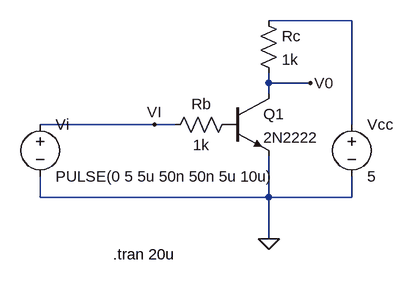
[diagram p0: schematic 1.2.3.asc]
1.2.3.asc, the LTspice schematic file:
Version 4
SHEET 1 880 680
WIRE 384 -32 256 -32
WIRE 256 64 256 48
WIRE 320 64 256 64
WIRE 256 80 256 64
WIRE 80 128 -96 128
WIRE 112 128 80 128
WIRE 384 128 384 -32
WIRE -96 240 -96 208
WIRE 256 240 256 176
WIRE 256 240 -96 240
WIRE 384 240 384 208
WIRE 384 240 256 240
WIRE 256 304 256 240
FLAG 256 304 0
FLAG 320 64 V0
FLAG 80 128 VI
SYMBOL voltage -96 112 R0
WINDOW 123 24 124 Left 2
WINDOW 39 0 0 Left 0
SYMATTR InstName Vi
SYMATTR Value PULSE(0 5 5u 50n 50n 5u 10u)
SYMBOL voltage 384 112 R0
WINDOW 123 0 0 Left 0
WINDOW 39 0 0 Left 0
SYMATTR InstName Vcc
SYMATTR Value 5
SYMBOL res 240 -48 R0
SYMATTR InstName Rc
SYMATTR Value 1k
SYMBOL res 208 112 R90
WINDOW 0 0 56 VBottom 2
WINDOW 3 32 56 VTop 2
SYMATTR InstName Rb
SYMATTR Value 1k
SYMBOL npn 192 80 R0
SYMATTR InstName Q1
SYMATTR Value 2N2222
TEXT 16 328 Left 2 !.tran 20u

The netlist it stands for:
* 1.2.3.asc
Vi VI 0 PULSE(0 5 5u 50n 50n 5u 10u)
Vcc N001 0 5
Rc N001 V0 1k
Rb P001 VI 1k
Q1 V0 P001 0 0 2N2222
.model NPN NPN
.model PNP PNP
.lib standard.bjt
.tran 20u
.backanno
.end